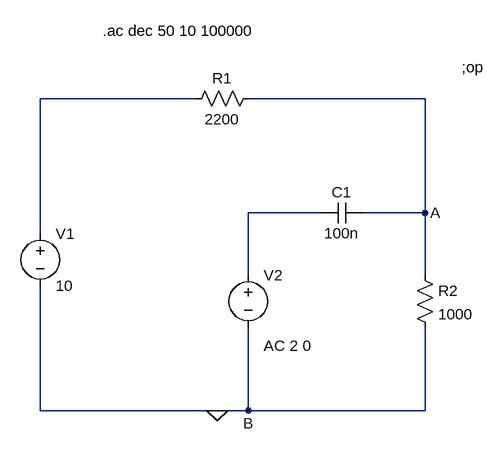
[diagram p0: schematic practica4_simulacion.asc]
practica4_simulacion.asc, the LTspice schematic file:
Version 4
SHEET 1 880 680
WIRE 176 -256 -64 -256
WIRE 528 -256 256 -256
WIRE 368 -80 256 -80
WIRE 528 -80 528 -256
WIRE 528 -80 432 -80
WIRE -64 -48 -64 -256
WIRE 256 16 256 -80
WIRE 528 16 528 -80
WIRE -64 224 -64 32
WIRE 208 224 -64 224
WIRE 256 224 256 96
WIRE 256 224 208 224
WIRE 528 224 528 96
WIRE 528 224 256 224
FLAG 528 -80 A
FLAG 208 224 0
FLAG 256 224 B
SYMBOL res 160 -240 R270
WINDOW 0 32 56 VTop 2
WINDOW 3 0 56 VBottom 2
SYMATTR InstName R1
SYMATTR Value 2200
SYMBOL res 512 0 R0
SYMATTR InstName R2
SYMATTR Value 1000
SYMBOL voltage -64 -64 R0
WINDOW 123 0 0 Left 2
WINDOW 39 0 0 Left 2
SYMATTR InstName V1
SYMATTR Value 10
SYMBOL voltage 256 0 R0
WINDOW 3 24 96 Invisible 2
WINDOW 123 24 124 Left 2
WINDOW 39 0 0 Left 2
SYMATTR InstName V2
SYMATTR Value SINE(0 2)
SYMATTR Value2 AC 2 0
SYMBOL cap 432 -96 R90
WINDOW 0 0 32 VBottom 2
WINDOW 3 32 32 VTop 2
SYMATTR InstName C1
SYMATTR Value 100n
TEXT 584 -304 Left 2 !;op
TEXT 32 -360 Left 2 !.ac dec 50 10 100000

The netlist it stands for:
* practica4_simulacion.asc
R1 N001 A 2200
R2 A 0 1000
V1 N001 0 10
V2 N002 0 SINE(0 2) AC 2 0
C1 A N002 100n
;op
.ac dec 50 10 100000
.backanno
.end

* Results of the author's LTspice run, read from the files saved beside the schematic
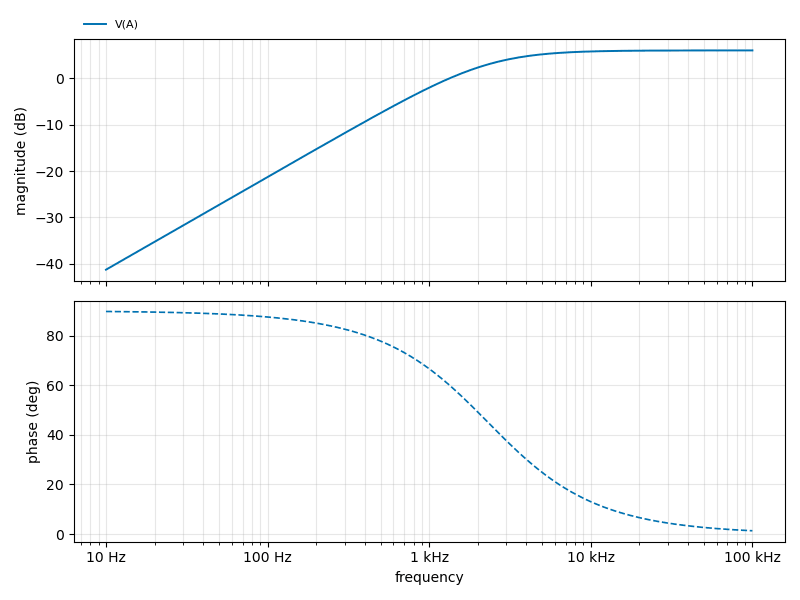
[diagram p1: AC Analysis of practica4_simulacion.asc, plotted from the saved traces]
* AC Analysis, 1 run:
*   V(A): -41.27 dB at 10 Hz, 6.02 dB at 100 kHz, peak 6.02 dB at 100 kHz, 3 dB below the peak at 2.314 kHz